# Altium project HeadTiltController_V1.PrjPcb
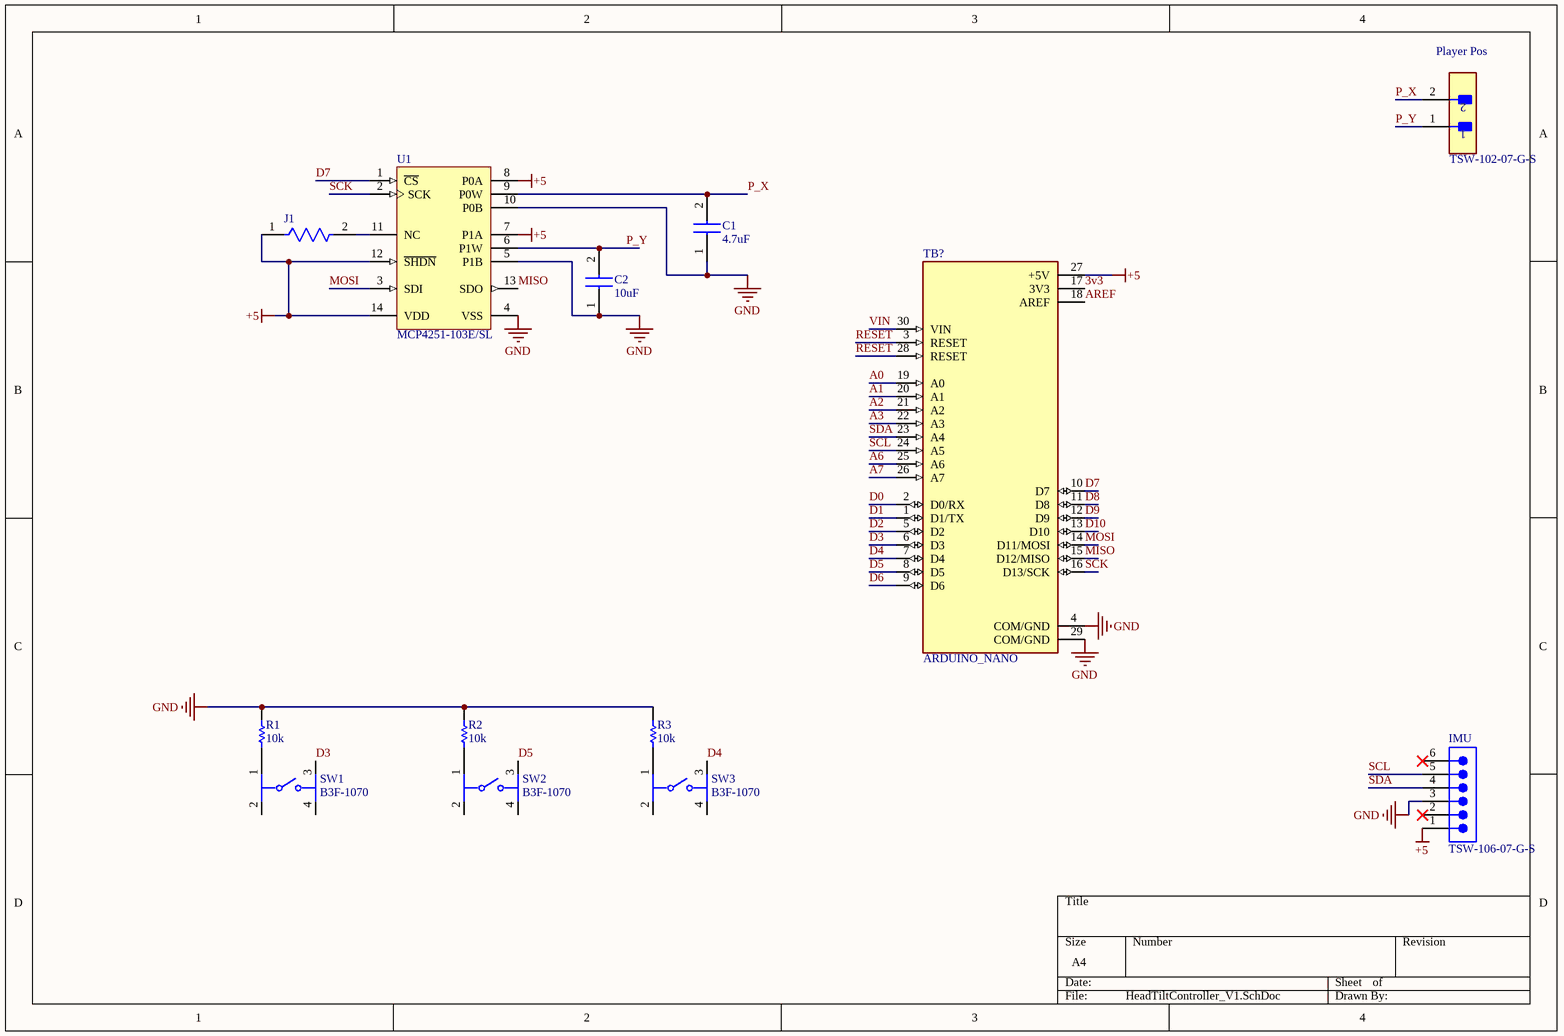
[diagram p0: HeadTiltController_V1.SchDoc]
1 sheet, 13 parts. Net scope: global (net labels, ports and power ports of the same name join across sheets).
Board file: HeadTiltController_V1.PcbDoc

## Sheet HeadTiltController_V1.SchDoc
size A4; SheetNumber: 1; SheetTotal: 1

### Parts
C1  4.7uF  [C322C475K5R5TA]
C2  10uF  [FG14]
IMU  TSW-106-07-G-S  [SMTC-TSW-106-07-X-S]
J1  (no value)  [FP-CRCW0805-e3-IPC_B]
Player_Pos  TSW-102-07-G-S  [FP-TSW-102-07-G-S-MFG]
R1  10k  [OMTE-RES7X2.5-2]
R2  10k  [OMTE-RES7X2.5-2]
R3  10k  [OMTE-RES7X2.5-2]
SW1  B3F-1070  [FP-B3F-1070-MFG]
SW2  B3F-1070  [FP-B3F-1070-MFG]
SW3  B3F-1070  [FP-B3F-1070-MFG]
TB?  ARDUINO_NANO  [SHIELD_ARDUINO_NANO]
U1  MCP4251-103E/SL  [SOIC-SL14_N]

### Nets
+5: IMU.1 J1.1 TB?.27(+5V) U1.7(P1A) U1.8(P0A) U1.12(~{SHDN}) U1.14(VDD)
GND: C1.1 C2.1 IMU.3 R1.2 R2.2 R3.2 TB?.4(COM/GND) TB?.29(COM/GND) U1.4(VSS) U1.5(P1B) U1.10(P0B)
3v3: TB?.17(3V3)
A0: TB?.19(A0)
A1: TB?.20(A1)
A2: TB?.21(A2)
A3: TB?.22(A3)
A6: TB?.25(A6)
A7: TB?.26(A7)
AREF: TB?.18(AREF)
D0: TB?.2(D0/RX)
D1: TB?.1(D1/TX)
D2: TB?.5(D2)
D3: SW1.3 TB?.6(D3)
D4: SW3.3 TB?.7(D4)
D5: SW2.3 TB?.8(D5)
D6: TB?.9(D6)
D7: TB?.10(D7) U1.1(~{CS})
D8: TB?.11(D8)
D9: TB?.12(D9)
D10: TB?.13(D10)
MISO: TB?.15(D12/MISO) U1.13(SDO)
MOSI: TB?.14(D11/MOSI) U1.3(SDI)
P_X: C1.2 Player_Pos.2 U1.9(P0W)
P_Y: C2.2 Player_Pos.1 U1.6(P1W)
RESET: TB?.3(RESET) TB?.28(RESET)
SCK: TB?.16(D13/SCK) U1.2(SCK)
SCL: IMU.5 TB?.24(A5)
SDA: IMU.4 TB?.23(A4)
VIN: TB?.30(VIN)
NetJ1_2: J1.2 U1.11(NC)
NetR1_1: R1.1 SW1.1
NetR2_1: R2.1 SW2.1
NetR3_1: R3.1 SW3.1

Not connected (* = marked no-connect by the designer): IMU 2* 6*; SW1 2 4; SW2 2 4; SW3 2 4

### Library data of the parts
C1 = C322C475K5R5TA: Capacitor; Manufacturer_Name: KEMET; Datasheet Link: https://content.kemet.com/datasheets/KEM_C1050_GOLDMAX_X7R.pdf; Height: 6.6mm; Manufacturer_Part_Number: C322C475K5R5TA; Mouser Part Number: 80-C322C475K5R; Mouser Price/Stock: https://www.mouser.co.uk/ProductDetail/KEMET/C322C475K5R5TA?qs=Tap6ps20mlO6CIfw6QCGhw%3D%3D; Arrow Part Number: C322C475K5R5TA; Arrow Price/Stock: https://www.arrow.com/en/products/c322c475k5r5ta/kemet-corporation
C2 = FG14X7R1A106KRT00: Capacitor; Manufacturer_Name: TDK; Datasheet Link: https://product.tdk.com/system/files/dam/doc/product/capacitor/ceramic/lead-mlcc/catalog/leadmlcc_halogenfree_fg_en.pdf; Height: 5.5mm; Manufacturer_Part_Number: FG14X7R1A106KRT00; Mouser Part Number: 810-FG14X7R1A106KRT0; Mouser Price/Stock: https://www.mouser.co.uk/ProductDetail/TDK/FG14X7R1A106KRT00?qs=vNwBHymccZ%2FEb8yxejO5lg%3D%3D
IMU = CMP-1024-00383-1: 0.025" SQ Post Header, Through-hole, Vertical, -55 to 125 degC, 2.54 mm Pitch, 6-Pin, Male, RoHS; Manufacturer: Samtec; Pitch: 2.54 mm; RoHS: True; ComponentLink1Description: Manufacturer URL; DatasheetVersion: F-214; Orientation: Vertical; ComponentLink1URL: http://www.samtec.com; ComponentLink3Description: Package Specification; ComponentLink2Description: Datasheet; PackageVersion: DM, 8/1988; PackageDescription: .025[0.64] SQ. Post Terminal Strip Assembly; PackageReference: TSW-106-07-X-S; Mounting Technology: Through-hole; Temperature Range: -55 to 125 degC; ComponentLink3URL: http://www.samtec.com/documents/webfiles/cpdf/TSW-XXX-XX-XXX-X-XX-XXX-MKT.pdf; ComponentLink2URL: http://www.samtec.com/documents/webfiles/pdf/TSW_TH.PDF; PartNumber: TSW-106-07-G-S
J1 = CMP-2001-04897-2: RES Thick Film, 0Ω, 0.125W, 0805; Power Rating: 125mW; Resistance: 0mR; Voltage Rating: 150V; Length: 2mm; Width: 0.049inch; Weight: 0.000194oz; Composition: Thick Film; Contact Plating: Tin; Max Power Dissipation: 125mW; Min Operating Temperature: -55°C; Packaging: Tape and Reel; Number of Terminations: 2; Package Quantity: 10000; Case Code (Imperial): 0805; Military Standard: Not; Height: 0.02inch; Features: Automotive AEC-Q200; Depth: 1.25mm; Radiation Hardening: No; Lead Free: Lead Free; Case Code (Metric): 2012; Case/Package: 0805; Voltage Rating (DC): 150V; Termination: SMD/SMT; Max Operating Temperature: 155°C
Player_Pos = CMP-02766-000084-1: CONN HEADER VERT 2POS 2.54MM; Manufacturer: Samtec; Number Of Contacts: 2; Voltage Rating: 550V; Conn Orientation: Straight; Current Rating: 6.3A; Conn Gender: Male; Package: TSW-102-07-G-S; Digikey Description: CONN HEADER VERT 2POS 2.54MM; ComponentLink2URL: http://suddendocs.samtec.com/catalog_english/tsw_th.pdf; Height: 8.71mm; Temperature: -55°C to +125°C; Device Class L2: Headers and Wire Housings; ComponentLink2Description: Datasheet; Device Class L3: unset; Contact Material: Gold,Nickel; Temperature Range Low: -55°C; Temperature Range High: +125°C; RoHS: TRUE; Device Class L1: Connectors; Mouser Description: Conn Unshrouded Header HDR 2 POS 2.54mm Solder ST Thru-Hole Automotive Bulk; Number Of Rows: 1; Category: Conn; Pitch: 2.54mm; Lead Free: Yes; Automotive: No; Manufacturer Part Number: TSW-102-07-G-S; Footprint Url: http://suddendocs.samtec.com/prints/tsw-xxx-xx-x-x-xx-xxx-footprint.pdf; Octopart: https://octopart.com/tsw-102-07-g-s-samtec-272197
R1-R3 = CMP-2000-06865-1: Little Demon(R) Carbon Composition Molded OD Series, 250 V, 10 KOhm, +/-5%, -70 to 130 degC, 2-Pin THD, RoHS, Bulk; PartNumber: OD103JE; Manufacturer: Ohmite; Power Rating: 0.25W; Power (Watts): 0.25W,1/4W; Tolerance: ±5%; Online Catalog: OD,OF,OASeries,LittleDemon®; Catalog Drawings: OD,OF,OASeries; EDA / CAD Models: DownloadfromAcceleratedDesigns; Mounting Technology: ThroughHole; Datasheet Version: 06/2016; RoHS Information: LittleDemon"E"SeriesMaterialDeclaration; Number of Terminations: 2; Temperature Coefficient: -; Height: -; Resistance (Ohms): 10k; Composition: CarbonComposition; Package Description: 2-Pin THD Resistor, Body 7 x 2.5 mm, Lead Dia. 0.6 mm; Size / Dimension: 0.098"Diax0.276"L(2.50mmx7.00mm); Category: Resistors; Manufacturer URL: http://www.ohmite.com/; Features: PulseWithstanding; Family: ThroughHoleResistors; Supplier Device Package: Axial; Package / Case: Axial; Standard Package: 100; Package Reference: RES7X2.5; Operating Temperature: -; Series: LittleDemon®OD; Datasheet URL: http://www.ohmite.com/cat/res_od_of_oa.pdf; Packaging: Bulk
SW1-SW3 = CMP-08834-000056-1: SWITCH TACTILE SPST-NO 0.05A 24V; Number of Poles: 1; Actuator Color: Black; Contact Current Rating: 50mA; Contact Resistance: 100mR; Switch Function: Off-Mom; Operating Force: 0.98N; Actuator Length: 6.1mm; Electrical Life: 1000000Cycles; Throw Configuration: SPST; Switch Travel: 0.25mm; Actuator Type: Standard; Illumination Type: Non-Illuminated; Mechanical Life: 500000Cycles; Orientation: Straight; Max Operating Temperature: 70°C; Mount: Through Hole; Packaging: Bulk; Contact Material: Gold; Package Quantity: 1000; Max Voltage Rating (DC): 24V; Max Current Rating: 50mA; Lead Free: Lead Free; Min Operating Temperature: -25°C; Length: 6mm; RoHS Compliant: Yes; Depth: 7.7mm; Current Rating: 50mA; Contact Plating: Silver; Termination: PC Pins; Voltage Rating (DC): 24V; Insulation Resistance: 100MR; Series: B3F; Weight: 0.25g
TB? = ARDUINO_NANO: Small, complete, and breadboard-friendly board based on the ATmega328 (Arduino Nano 3.x); Check_prices: https://www.snapeda.com/parts/Arduino%20Nano/Arduino/view-part/?ref=eda; Value: *; Availability: Not in stock; MP: Arduino Nano; Price: None; Package: Non-Standard Arduino; SnapEDA_Link: https://www.snapeda.com/parts/Arduino%20Nano/Arduino/view-part/?ref=snap; MF: Arduino
U1 = CMP-0188-00503-2: 7/8-Bit Single/Dual SPI Digital POT with Volatile Memory, 14-Pin SOIC 150mil, Extended Temperature; ComponentLink1URL: http://www.microchip.com/; PackageVersion: revBB, Aug-2009; ComponentLink3URL: http://www.microchip.com/stellent/groups/techpub_sg/documents/packagingspec/en012702.pdf; Code_JEDEC: MS-012-AB; DatasheetVersion: revB, Dec-2008; PackageReference: SOIC-SL14; ComponentLink2URL: http://ww1.microchip.com/downloads/en/DeviceDoc/22060b.pdf; Code_IPC: SOIC127P600-14; ComponentLink1Description: Manufacturer URL; RevisionNote: URLs added.; ComponentLink2Description: Datasheet; ComponentLink3Description: Package Specification; PackageDescription: 14-Lead Plastic Small Outline (SL) - Narrow, 3.90mm Body [SOIC]